# EAGLE design PL9823-breakout-board (EAGLE 6.5.0)
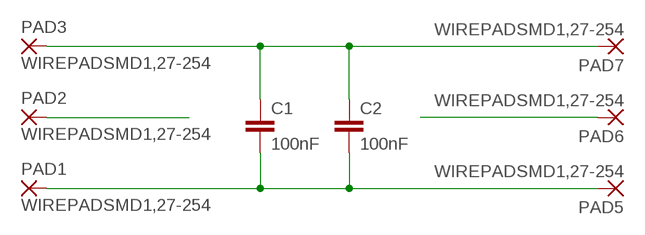
[diagram p0: schematic, sheet 1]

## Parts
C1  100nF  C-EUC0805K  [C0805K]
C2  100nF  C-EUC0805K  [C0805K]
PAD1  WIREPADSMD1,27-254  [SMD1,27-2,54]
PAD2  WIREPADSMD1,27-254  [SMD1,27-2,54]
PAD3  WIREPADSMD1,27-254  [SMD1,27-2,54]
PAD5  WIREPADSMD1,27-254  [SMD1,27-2,54]
PAD6  WIREPADSMD1,27-254  [SMD1,27-2,54]
PAD7  WIREPADSMD1,27-254  [SMD1,27-2,54]

## Nets
+: C1.1 C2.1 PAD3.1(P) PAD7.1(P)
-: C1.2 C2.2 PAD1.1(P) PAD5.1(P)
DI: PAD2.1(P)
DO: PAD6.1(P)

## Library data of the parts
C1 C2 = rcl:C-EU: CAPACITOR, European symbol
PAD1-PAD3 PAD5-PAD7 = wirepad:WIREPAD: Wire PAD connect wire on PCB

## Net classes
0 default: clearance 0.205 mm

## Board
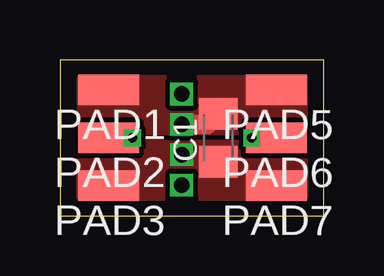
[diagram p1: board, top side]
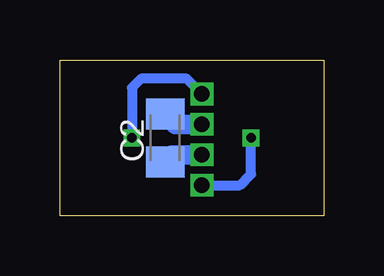
[diagram p2: board, bottom side, seen from below]

Size 11 x 6.5 mm. Coordinates in mm from the lower left corner, seen from the top.
Outline: 0,0 11,0 11,6.5 0,6.5 0,0
Copper layers (1*16): Top 0.035mm / dielectric 1.5mm / Bottom 0.035mm
Design rules "smart-prototyping": minimum track width 7mil, minimum drill 12mil, track to track 7mil, track to pad 7mil, pad to pad 7mil, via to via 7mil, smd to smd 0mil, copper to edge 20mil, drill to drill 10mil, minimum pad ring 10mil, minimum via ring 6mil, stop-mask expansion 2mil, vias tented up to drill 25mil, thermal gap 10mil

### Footprints (pad centres in the part's own frame; a part is rotated, then mirrored left to right if it is on the bottom)
C0805K = smd 1.3 x 1.6: 1 -1,0; 2 1,0
SMD1,27-2,54 = smd 1.27 x 2.54: 1 0,0

### Placement (x,y rotation side)
C1  6.61,3.25 90 top
C2  6.61,3.24 90 bottom
PAD1  2.02,5.24 90 top
PAD2  2.02,3.24 90 top
PAD3  2.02,1.24 90 top
PAD5  9.02,5.24 90 top
PAD6  9.02,3.24 90 top
PAD7  9.02,1.24 90 top

### Tracks (layer width: path | path; a pad name or v marks a point on that pad's centre or on a via)
+  (via drill 0.64)
  Bottom 0.813: C2.1 6.31,2.54 v5.08,2.54
  pour Top (isolate 0.2, no thermals): 0.82,3.04 10.22,3.04 10.22,0.74 0.82,0.74
-  (via drill 0.64)
  Top 0.813: C1.2 6.16,3.81 v5.08,3.81
  Bottom 0.813: C2.2 6.18,3.81 v5.08,3.81
  pour Top (isolate 0.2, rank 2, no thermals): 0.82,3.44 10.22,3.44 10.22,5.74 0.82,5.74
DI  (via drill 0.4, 0.64)
  Top 0.406: v3.02,3.24 PAD2.1
  Bottom 0.406: v5.08,1.27 3.49,1.27 3.02,1.74 v3.02,3.24
DO  (via drill 0.4, 0.64)
  Top 0.406: 8.5,3.24 PAD6.1
  Top 0.61: v8,3.25 v8,3.24 8.5,3.24
  Bottom 0.406: v5.08,5.08 5.71,5.71 7.62,5.71 8,5.33 v8,3.24

### Text on the board
tValues: LONG | - | - | DI | DO | + | * | +
bValues: long | *short